# Altium schematic sheet Micro.SchDoc
size A; SheetNumber: 4; SheetTotal: 6
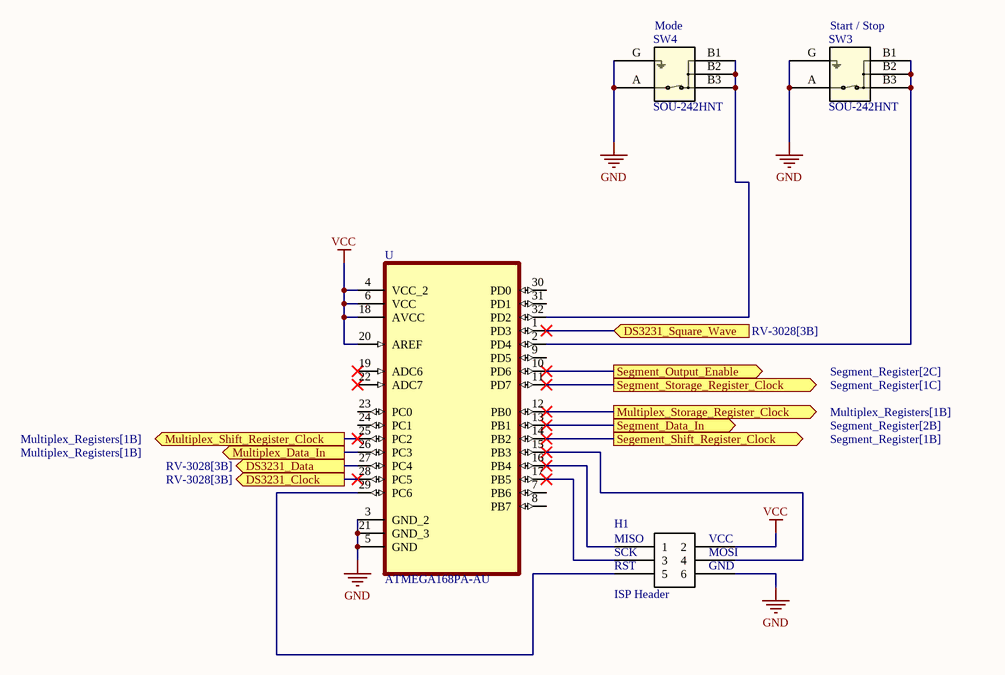
[diagram p0: Micro.SchDoc]

## Parts
H1  ISP Header  [ISP Header]
SW3  SOU-242HNT  [SOU-242HNT_MIT]
SW4  SOU-242HNT  [SOU-242HNT_MIT]
U  ATMEGA168PA-AU  [QFP80P900X900X120-32N]

## Ports
DS3231_Clock (out, see RV-3028[3B]), DS3231_Data (out, see RV-3028[3B]), DS3231_Square_Wave (in, see RV-3028[3B]), Multiplex_Data_In (out, see Multiplex_Registers[1B]), Multiplex_Shift_Register_Clock (out, see Multiplex_Registers[1B]), Multiplex_Storage_Register_Clock (out, see Multiplex_Registers[1B]), Segement_Shift_Register_Clock (out, see Segment_Register[1B]), Segment_Data_In (out, see Segment_Register[2B]), Segment_Output_Enable (out, see Segment_Register[2C]), Segment_Storage_Register_Clock (out, see Segment_Register[1C])

## Nets
GND: H1.6 SW3.A SW3.G SW4.A SW4.G U.3(GND_2) U.5(GND) U.21(GND_3)
VCC: H1.2 U.4(VCC_2) U.6(VCC) U.18(AVCC) U.20(AREF)
DS3231_Clock: U.28(PC5) ; port DS3231_Clock
DS3231_Data: U.27(PC4) ; port DS3231_Data
DS3231_Square_Wave: U.1(PD3) ; port DS3231_Square_Wave
Multiplex_Data_In: U.26(PC3) ; port Multiplex_Data_In
Multiplex_Shift_Register_Clock: U.25(PC2) ; port Multiplex_Shift_Register_Clock
Multiplex_Storage_Register_Clock: U.12(PB0) ; port Multiplex_Storage_Register_Clock
Segement_Shift_Register_Clock: U.14(PB2) ; port Segement_Shift_Register_Clock
Segment_Data_In: U.13(PB1) ; port Segment_Data_In
Segment_Output_Enable: U.10(PD6) ; port Segment_Output_Enable
Segment_Storage_Register_Clock: U.11(PD7) ; port Segment_Storage_Register_Clock
NetH1_1: H1.1 U.16(PB4)
NetH1_3: H1.3 U.17(PB5)
NetH1_4: H1.4 U.15(PB3)
NetH1_5: H1.5 U.29(PC6)
NetSW3_B1: SW3.B1 SW3.B2 SW3.B3 U.2(PD4)
NetSW4_B1: SW4.B1 SW4.B2 SW4.B3 U.32(PD2)

Not connected (* = marked no-connect by the designer): U 7(PB6) 8(PB7) 9(PD5) 19(ADC6)* 22(ADC7)* 23(PC0) 24(PC1) 30(PD0) 31(PD1)

## Notes on the sheet
- (near SW4) Mode
- (near SW3) Start / Stop
- (in symbol ISP Header) MISO; VCC; SCK; MOSI; RST; GND

## Library data of the parts
SW3 SW4 = SOU-242HNT: SWITCH TACTILE, SPST-NO, 0.05A 1; Mfr_Name: Mitsumi; Copyright: Copyright (C) 2022 Ultra Librarian. All rights reserved.; Manufacturer_Part_Number: SOU-242HNT; Digi-Key_Part_Number_1: 12-SOU-242HNTTR-ND; Digi-Key_Part_Number_2: 12-SOU-242HNTCT-ND; Digi-Key_Part_Number_3: 12-SOU-242HNTDKR-ND; RefDes: RefDes; Type: DEV; Supplier 1: Digi-Key; Supplier 2: Digi-Key; Supplier 3: Digi-Key
U = ATMEGA168PA-AU: AVR AVRÂ® ATmega Microcontroller IC 8-Bit 20MHz 16KB _8K x 16_ FLASH 32-TQFP _7x7_; MF: Microchip; SnapEDA_Link: https://www.snapeda.com/parts/ATMEGA168PA-AU/Microchip/view-part/1772950/?ref=snap; Price: None; Availability: Unavailable; MP: ATMEGA168PA-AU; Value: *; Package: TQFP-32 Microchip